# Altium schematic sheet [9]GPSGNSS.SchDoc
size B
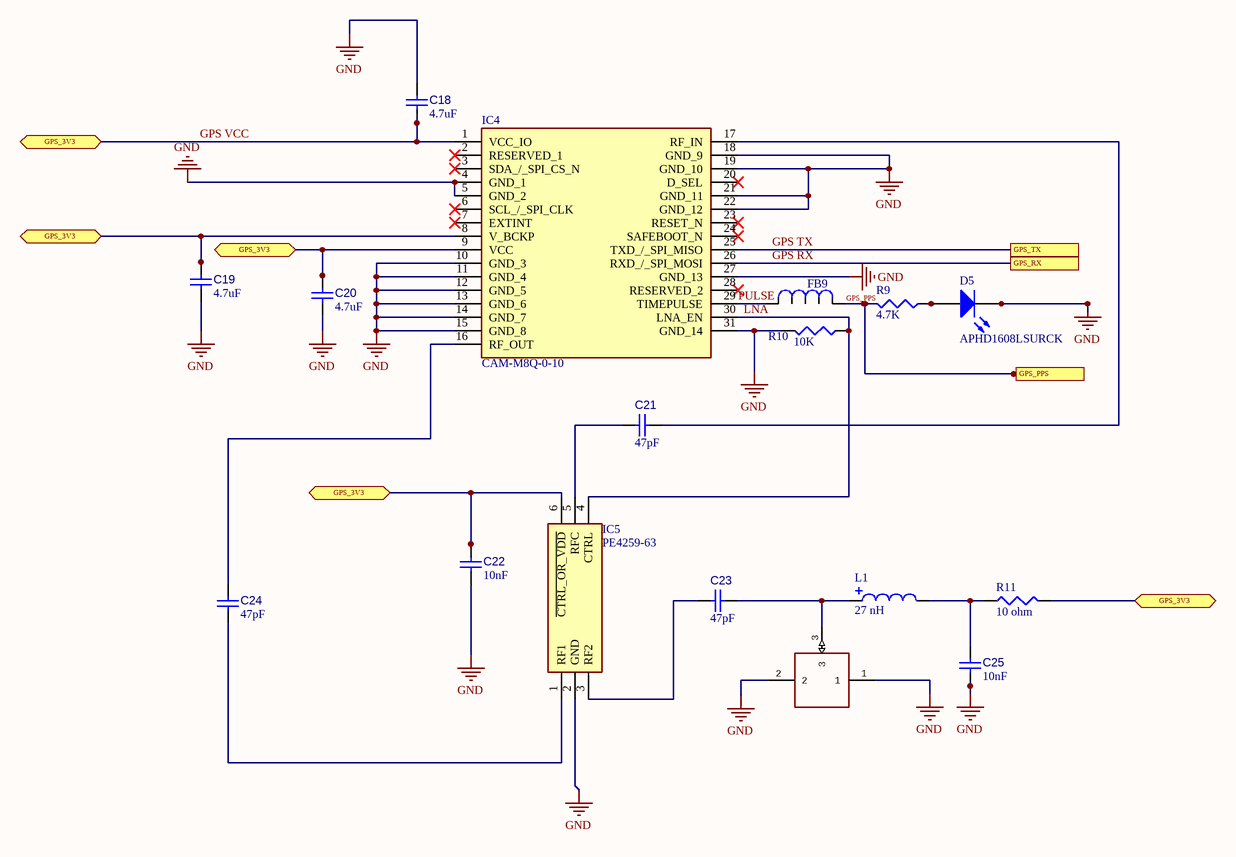
[diagram p0: [9]GPSGNSS.SchDoc]

## Parts
C18  4.7uF  [CAPC1608X90X40ML10T20]
C19  4.7uF  [CAPC1608X90X40ML10T20]
C20  4.7uF  [CAPC1608X90X40ML10T20]
C21  47pF  [CAPC1608X90X40ML10T20]
C22  10nF  [CAPC1608X90X40ML10T20]
C23  47pF  [CAPC1608X90X40ML10T20]
C24  47pF  [CAPC1608X90X40ML10T20]
C25  10nF  [CAPC1608X90X40ML10T20]
CONN2  U.FL-R-SMT-1  [U.FL-R-SMT-1]  (value not drawn)
D5  APHD1608LSURCK  [LED BLUE CLEAR [0603] 2mA]
FB9  BLM18AG102SN1D  [Ferrite Bead]  (value not drawn)
IC4  CAM-M8Q-0-10  [CAM-M8Q]
IC5  PE4259-63  [SOT65P210X110-6N]
L1  27 nH  [INDC1005X55X25ML5T10]
R9  4.7K  [RESC0603]
R10  10K  [RESC0603]
R11  10 ohm  [RESC0603]

## Ports
GPS_3V3 (bidir), GPS_PPS, GPS_RX, GPS_TX

## Nets
GND: C18.1 C19.2 C20.2 C22.1 C25.1 CONN2.1 CONN2.2 D5.1 IC4.4(GND_1) IC4.5(GND_2) IC4.10(GND_3) IC4.11(GND_4) IC4.12(GND_5) IC4.13(GND_6) IC4.14(GND_7) IC4.15(GND_8) IC4.18(GND_9) IC4.19(GND_10) IC4.21(GND_11) IC4.22(GND_12) IC4.27(GND_13) IC4.31(GND_14) IC5.2(GND) R10.2
GPS RX: IC4.26(RXD_/_SPI_MOSI) ; port GPS_RX
GPS TX: IC4.25(TXD_/_SPI_MISO) ; port GPS_TX
GPS VCC: C18.2 C19.1 C20.1 C22.2 IC4.1(VCC_IO) IC4.8(V_BCKP) IC4.9(VCC) IC5.6(~{CTRL_OR_VDD}) R11.2 ; port GPS_3V3
GPS_PPS: FB9.2 R9.2 ; port GPS_PPS
LNA: IC4.30(LNA_EN) IC5.4(CTRL) R10.1
PULSE: FB9.1 IC4.29(TIMEPULSE)
NetC21_1: C21.1 IC5.5(RFC)
NetC21_2: C21.2 IC4.17(RF_IN)
NetC23_1: C23.1 IC5.3(RF2)
NetC23_2: C23.2 CONN2.3 L1.1
NetC24_1: C24.1 IC5.1(RF1)
NetC24_2: C24.2 IC4.16(RF_OUT)
NetC25_2: C25.2 L1.2 R11.1
NetD5_2: D5.2 R9.1

Not connected (* = marked no-connect by the designer): IC4 2(RESERVED_1)* 3(SDA_/_SPI_CS_N)* 6(SCL_/_SPI_CLK)* 7(EXTINT)* 20(D_SEL)* 23(RESET_N)* 24(SAFEBOOT_N)* 28(RESERVED_2)*

## Library data of the parts
C18-C20 = CMP-001-00017-4: Chip Capacitor, 4.7uF, +/- 10%, 50 V, 0603 (1608 Metric); Capacitor Type: Ceramic; Voltage Rating: 50V; RoHS Compliant: True; Value: 4.7uF; Max Operating Temperature: 125°C; Pins: 2; Mounting Technology: SM; Min Operating Temperature: -55°C; Tolerance: 10%; Case/Package: 0603
C21 C23 C24 = CMP-001-00017-4: Chip Capacitor, 47pF, +/- 10%, 50 V, 0603 (1608 Metric); Capacitor Type: Ceramic; Voltage Rating: 50V; RoHS Compliant: True; Value: 47pF; Max Operating Temperature: 125°C; Pins: 2; Mounting Technology: SM; Min Operating Temperature: -55°C; Tolerance: 10%; Case/Package: 0603
C22 C25 = CMP-001-00017-4: Chip Capacitor, 10 nF, +/- 10%, 50 V, 0603 (1608 Metric); Capacitor Type: Ceramic; Voltage Rating: 50V; RoHS Compliant: True; Value: 10nF; Max Operating Temperature: 125°C; Pins: 2; Mounting Technology: SM; Min Operating Temperature: -55°C; Tolerance: 10%; Case/Package: 0603
CONN2 = U.FL-R-SMT-1: GateName_1: G$1; SymbolName_1: U.FL-R-SMT-1; LibraryName: Kris; DeviceSetName: U.FL-R-SMT-1
D5 = LED BLUE CLEAR 1608 SMD: LED RED  [0603] 2mA; Datasheet: http://www.kingbrightusa.com/images/catalog/SPEC/APHD1608LQBC-D.pdf; Supplier 1: Digi-Key; Supplier Part Number 1: 754-2034-1-ND; PN: APHD1608LSURCK
FB9 = Ferrite Bead: Ferrite Bead 1KOhm @100MHz; Datasheet: https://www.murata.com/en-us/products/productdata/8796738650142/ENFA0003.pdf?src-supplier=Digi-Key; Supplier 1: Mouser; Supplier Part Number 1: 81-BLM11A102S; PN: BLM18AG102SN1D
IC4 = CAM-M8Q-0-10: Integrated Circuit; Manufacturer_Name: U-Blox; Datasheet Link: https://www.u-blox.com/sites/default/files/CAM-M8-FW3_DataSheet_%28UBX-15031574%29.pdf; Manufacturer_Part_Number: CAM-M8Q-0-10
IC5 = PE4259-63: Integrated Circuit; Manufacturer_Name: Peregrine Semiconductor; Datasheet Link: https://www.psemi.com/pdf/datasheets/pe4259ds.pdf; Height: 1.1mm; Manufacturer_Part_Number: PE4259-63; ComponentLink1Description: doc; ComponentLink1URL: https://www.psemi.com/pdf/datasheets/pe4259ds.pdf
L1 = CMP-006-00007-2: Chip Inductor, 27 nH, +/- 0.3 nH, 300 mA, -55 to 125 degC, 0402 (1005 Metric), RoHS, Tape and Reel; Manufacturer: Murata; Resistance: 0.15Ohm; Self Resonant Frequency: 6GHz; Tolerance: 5%; Current Rating: 300mA; Inductance: 27nH; Q Factor: 8; Core Material: Air; Shielding: Unshielded; Value: 27 nH; Package Reference: 0402; Case/Package: 0402; Packaging: TapeandReel; Max Operating Temperature: 125°C; RoHS Compliant: True; Package Description: 2-Pin Surface Mount Device, Body 1 x 0.5 mm; Min Operating Temperature: -55°C; Mounting Technology: SM; Pins: 2; Datasheet URL: http://industrial.panasonic.com/cdbs/www-data/pdf/AGA0000/AGA0000C49.pdf; Package Quantity: 10000; Datasheet Version: Sep-10
R9-R11 = RESISTOR